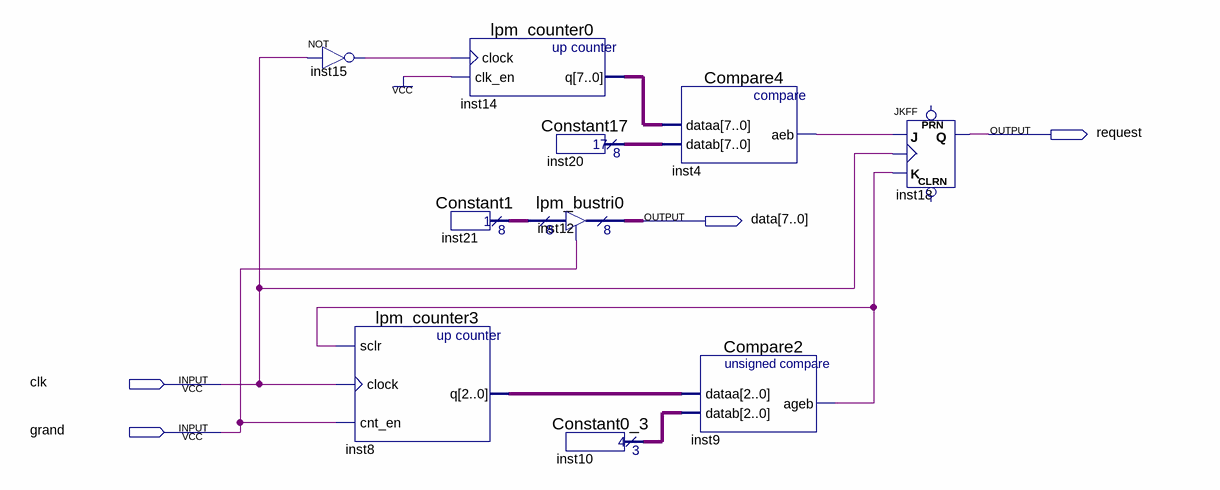
[diagram p0: schematic sheet]
// Quartus schematic Master1.bdf as structural Verilog: 10 symbols, 4 pins
module Master1 (
  input  clk,
  input  grand,
  output request,
  output [7:0] data
);

  wire inst4_aeb, inst9_ageb, inst15_out;
  wire [2:0] inst8_q, inst10_result;
  wire [7:0] inst14_q, inst20_result, inst21_result;

  not inst15 (inst15_out, clk);
  lpm_counter3 inst8 (.sclr(inst9_ageb), .clock(clk), .cnt_en(grand), .q(inst8_q));
  lpm_counter0 inst14 (.clock(inst15_out), .clk_en(1'b1), .q(inst14_q));
  Constant1 inst21 (.result(inst21_result));
  Constant17 inst20 (.result(inst20_result));
  lpm_bustri0 inst12 (.enabledt(grand), .data(inst21_result), .tridata(data));
  Constant0_3 inst10 (.result(inst10_result));
  Compare4 inst4 (.dataa(inst14_q), .datab(inst20_result), .aeb(inst4_aeb));
  Compare2 inst9 (.dataa(inst8_q), .datab(inst10_result), .ageb(inst9_ageb));
  JKFF inst18 (.K(inst9_ageb), .J(inst4_aeb), .CLK(clk), .Q(request));  // open: PRN, CLRN
endmodule
